# Altium schematic sheet WL-STUKTURNAY.SchDoc: WOLF-LITE
size 594 x 420 mm; Author: UA3REO/R7KBI; Address1: Address1; Address2: Address2; Address3: Address3; Address4: Address4; DocumentNumber: Wolf-Lite; SheetNumber: 1; SheetTotal: 12; Scale: 1:1; DocumentType: Схема электрическая принципиальная; FirstReferrence: АБВГ.123456.001
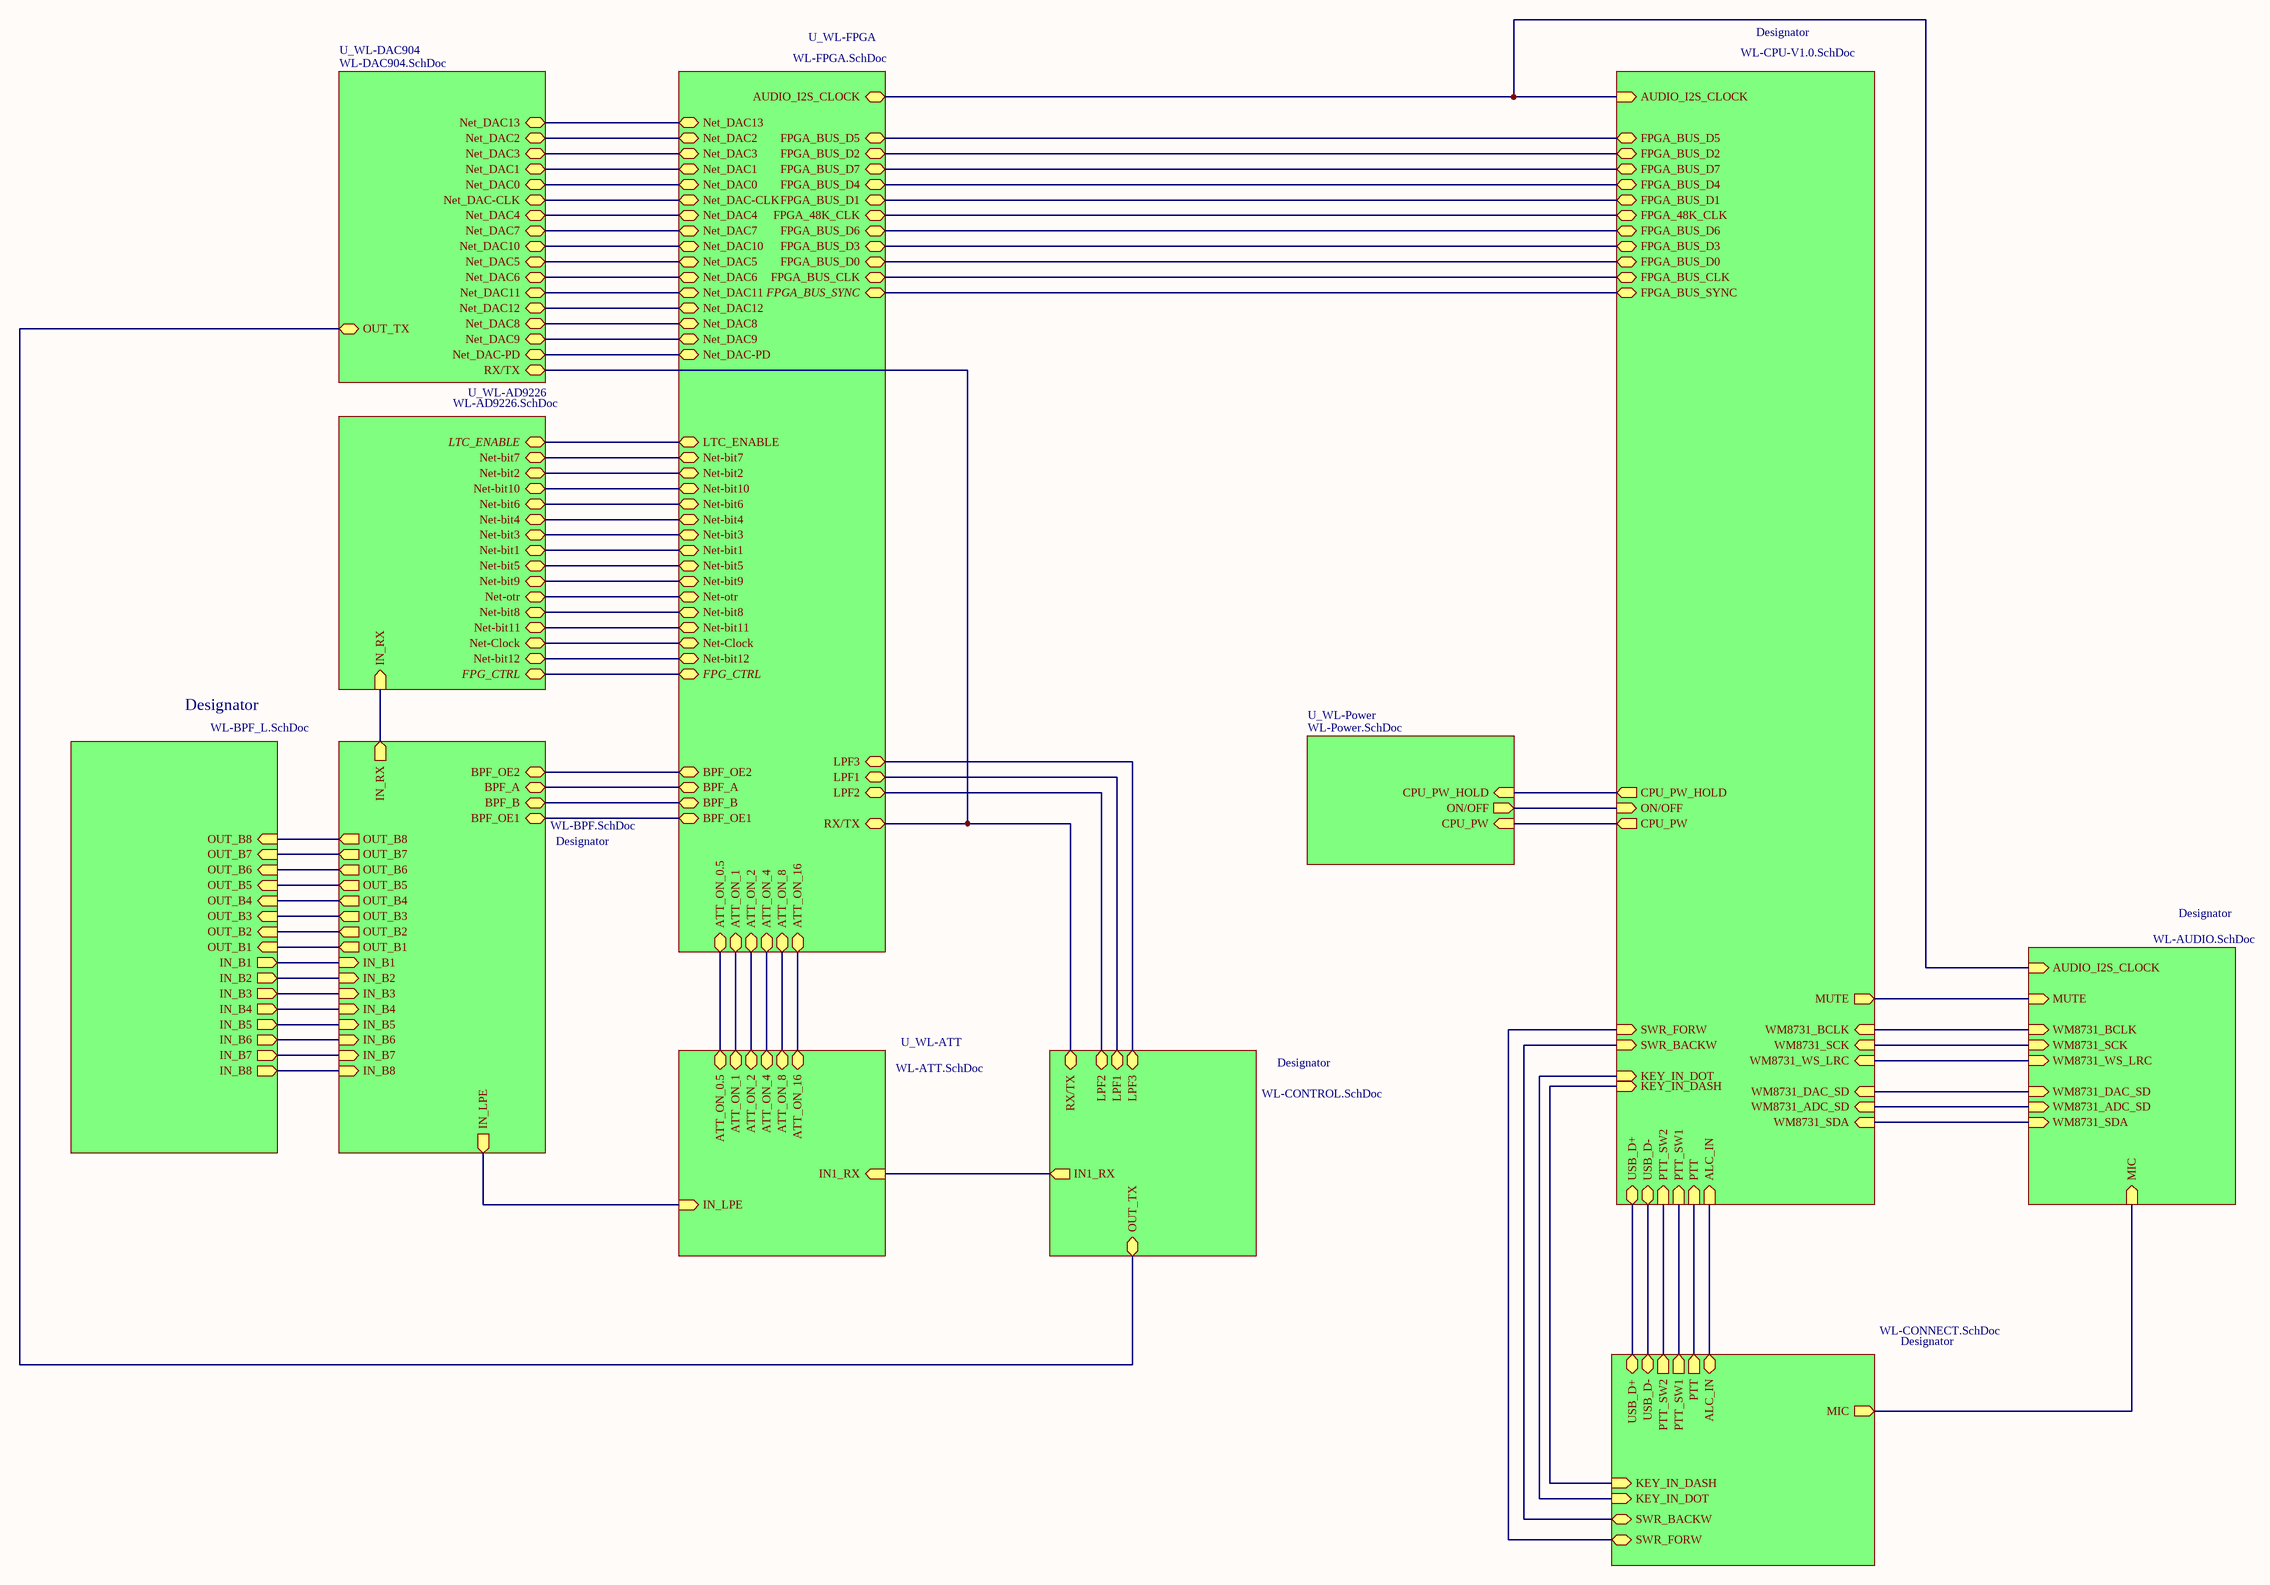
[diagram p0: WL-STUKTURNAY.SchDoc]

## Sub-sheets
Designator = WL-CPU-V1.0.SchDoc: MUTE (out), USB_D+ (bidir), USB_D- (bidir), PTT_SW2 (in), PTT_SW1 (in), PTT (in), FPGA_BUS_D5 (bidir), FPGA_BUS_D2 (bidir), FPGA_BUS_D7 (bidir), FPGA_BUS_D4 (bidir), FPGA_BUS_D1 (bidir), FPGA_48K_CLK (bidir), FPGA_BUS_D6 (bidir), FPGA_BUS_D3 (bidir), FPGA_BUS_D0 (bidir), FPGA_BUS_CLK (bidir), FPGA_BUS_SYNC (bidir), CPU_PW_HOLD (out), ON/OFF (in), CPU_PW (out), KEY_IN_DOT (in), KEY_IN_DASH (in), SWR_FORW (in), SWR_BACKW (in), ALC_IN (in), AUDIO_I2S_CLOCK (in), WM8731_SCK (in), WM8731_BCLK (in), WM8731_WS_LRC (in), WM8731_DAC_SD (in), WM8731_ADC_SD (in), WM8731_SDA (in)
Designator = WL-AUDIO.SchDoc: MUTE (in), MIC (in), WM8731_BCLK (in), WM8731_SCK (in), WM8731_WS_LRC (in), AUDIO_I2S_CLOCK (in), WM8731_DAC_SD (in), WM8731_ADC_SD (in), WM8731_SDA (in)
Designator = WL-CONTROL.SchDoc: OUT_TX (bidir), LPF2 (bidir), LPF1 (bidir), LPF3 (bidir), IN1_RX (out), RX/TX (bidir)
Designator = WL-BPF.SchDoc: IN_RX (out), BPF_OE2 (bidir), BPF_A (bidir), BPF_B (bidir), BPF_OE1 (bidir), OUT_B8 (out), OUT_B7 (out), OUT_B6 (out), OUT_B5 (out), OUT_B4 (out), OUT_B3 (out), OUT_B2 (out), OUT_B1 (out), IN_B1 (in), IN_B2 (in), IN_B3 (in), IN_B4 (in), IN_B5 (in), IN_B6 (in), IN_B7 (in), IN_B8 (in), IN_LPE (out)
Designator = WL-CONNECT.SchDoc: USB_D- (bidir), PTT (out), MIC (out), USB_D+ (bidir), PTT_SW2 (out), PTT_SW1 (out), ALC_IN (bidir), KEY_IN_DASH (in), KEY_IN_DOT (in), SWR_FORW (bidir), SWR_BACKW (bidir)
Designator = WL-BPF_L.SchDoc: OUT_B2 (in), OUT_B3 (in), OUT_B4 (in), OUT_B1 (in), IN_B1 (out), IN_B2 (out), IN_B3 (out), IN_B4 (out), OUT_B7 (in), OUT_B6 (in), OUT_B5 (in), IN_B7 (out), IN_B6 (out), IN_B5 (out), IN_B8 (out), OUT_B8 (in)
U_WL-AD9226 = WL-AD9226.SchDoc: Net-bit7 (bidir), Net-bit2 (bidir), Net-bit10 (bidir), Net-bit6 (bidir), Net-bit4 (bidir), Net-bit3 (bidir), Net-bit1 (bidir), Net-bit5 (bidir), Net-bit9 (bidir), Net-otr (bidir), Net-bit8 (bidir), Net-bit11 (bidir), Net-Clock (bidir), Net-bit12 (bidir), LTC_ENABLE (bidir), IN_RX (in), FPG_CTRL (bidir)
U_WL-ATT = WL-ATT.SchDoc: ATT_ON_1 (bidir), ATT_ON_2 (bidir), ATT_ON_16 (bidir), ATT_ON_8 (bidir), ATT_ON_4 (bidir), ATT_ON_0.5 (bidir), IN_LPE (in), IN1_RX (in)
U_WL-DAC904 = WL-DAC904.SchDoc: Net_DAC13 (bidir), Net_DAC2 (bidir), Net_DAC3 (bidir), Net_DAC1 (bidir), Net_DAC0 (bidir), Net_DAC-CLK (bidir), Net_DAC4 (bidir), Net_DAC7 (bidir), Net_DAC10 (bidir), Net_DAC5 (bidir), Net_DAC6 (bidir), Net_DAC11 (bidir), Net_DAC12 (bidir), Net_DAC8 (bidir), Net_DAC9 (bidir), OUT_TX (bidir), Net_DAC-PD (bidir), RX/TX (bidir)
U_WL-FPGA = WL-FPGA.SchDoc: FPGA_BUS_D5 (bidir), FPGA_BUS_D2 (bidir), FPGA_BUS_D7 (bidir), AUDIO_I2S_CLOCK (bidir), FPGA_BUS_D4 (bidir), FPGA_BUS_D1 (bidir), FPGA_48K_CLK (bidir), FPGA_BUS_D6 (bidir), FPGA_BUS_D3 (bidir), FPGA_BUS_D0 (bidir), FPGA_BUS_CLK (bidir), FPGA_BUS_SYNC (bidir), ATT_ON_0.5 (bidir), ATT_ON_1 (bidir), ATT_ON_2 (bidir), ATT_ON_4 (bidir), ATT_ON_8 (bidir), ATT_ON_16 (bidir), Net_DAC13 (bidir), Net_DAC2 (bidir), Net_DAC3 (bidir), Net_DAC1 (bidir), Net_DAC0 (bidir), Net_DAC-CLK (bidir), Net_DAC4 (bidir), Net_DAC7 (bidir), Net_DAC10 (bidir), Net_DAC5 (bidir), Net_DAC6 (bidir), Net_DAC11 (bidir), Net_DAC12 (bidir), Net_DAC8 (bidir), Net_DAC9 (bidir), Net-bit7 (bidir), Net-bit2 (bidir), Net-bit10 (bidir), Net-bit6 (bidir), Net-bit4 (bidir), Net-bit3 (bidir), Net-bit1 (bidir), Net-bit5 (bidir), Net-bit9 (bidir), Net-otr (bidir), Net-bit8 (bidir), Net-bit11 (bidir), Net-Clock (bidir), Net-bit12 (bidir), BPF_OE2 (bidir), BPF_A (bidir), BPF_B (bidir), BPF_OE1 (bidir), LPF2 (bidir), LPF1 (bidir), LPF3 (bidir), Net_DAC-PD (bidir), RX/TX (bidir), LTC_ENABLE (bidir), FPG_CTRL (bidir)
U_WL-Power = WL-Power.SchDoc: CPU_PW_HOLD (in), ON/OFF (out), CPU_PW (in)

## Nets
(unnamed): sheet U_WL-Power/CPU_PW_HOLD, sheet Designator/CPU_PW_HOLD
(unnamed): sheet U_WL-Power/ON/OFF, sheet Designator/ON/OFF
(unnamed): sheet U_WL-Power/CPU_PW, sheet Designator/CPU_PW
(unnamed): sheet U_WL-AD9226/Net-bit7, sheet U_WL-FPGA/Net-bit7
(unnamed): sheet U_WL-AD9226/Net-bit2, sheet U_WL-FPGA/Net-bit2
(unnamed): sheet U_WL-AD9226/Net-bit10, sheet U_WL-FPGA/Net-bit10
(unnamed): sheet U_WL-AD9226/Net-bit6, sheet U_WL-FPGA/Net-bit6
(unnamed): sheet U_WL-AD9226/Net-bit4, sheet U_WL-FPGA/Net-bit4
(unnamed): sheet U_WL-AD9226/Net-bit3, sheet U_WL-FPGA/Net-bit3
(unnamed): sheet U_WL-AD9226/Net-bit1, sheet U_WL-FPGA/Net-bit1
(unnamed): sheet U_WL-AD9226/Net-bit5, sheet U_WL-FPGA/Net-bit5
(unnamed): sheet U_WL-AD9226/Net-bit9, sheet U_WL-FPGA/Net-bit9
(unnamed): sheet U_WL-AD9226/Net-otr, sheet U_WL-FPGA/Net-otr
(unnamed): sheet U_WL-AD9226/Net-bit8, sheet U_WL-FPGA/Net-bit8
(unnamed): sheet U_WL-AD9226/Net-bit11, sheet U_WL-FPGA/Net-bit11
(unnamed): sheet U_WL-AD9226/Net-Clock, sheet U_WL-FPGA/Net-Clock
(unnamed): sheet U_WL-AD9226/Net-bit12, sheet U_WL-FPGA/Net-bit12
(unnamed): sheet U_WL-AD9226/LTC_ENABLE, sheet U_WL-FPGA/LTC_ENABLE
(unnamed): sheet U_WL-AD9226/IN_RX, sheet Designator/IN_RX
(unnamed): sheet U_WL-AD9226/FPG_CTRL, sheet U_WL-FPGA/FPG_CTRL
(unnamed): sheet U_WL-FPGA/FPGA_BUS_D5, sheet Designator/FPGA_BUS_D5
(unnamed): sheet U_WL-FPGA/FPGA_BUS_D2, sheet Designator/FPGA_BUS_D2
(unnamed): sheet U_WL-FPGA/FPGA_BUS_D7, sheet Designator/FPGA_BUS_D7
(unnamed): sheet U_WL-FPGA/AUDIO_I2S_CLOCK, sheet Designator/AUDIO_I2S_CLOCK, sheet Designator/AUDIO_I2S_CLOCK
(unnamed): sheet U_WL-FPGA/FPGA_BUS_D4, sheet Designator/FPGA_BUS_D4
(unnamed): sheet U_WL-FPGA/FPGA_BUS_D1, sheet Designator/FPGA_BUS_D1
(unnamed): sheet U_WL-FPGA/FPGA_48K_CLK, sheet Designator/FPGA_48K_CLK
(unnamed): sheet U_WL-FPGA/FPGA_BUS_D6, sheet Designator/FPGA_BUS_D6
(unnamed): sheet U_WL-FPGA/FPGA_BUS_D3, sheet Designator/FPGA_BUS_D3
(unnamed): sheet U_WL-FPGA/FPGA_BUS_D0, sheet Designator/FPGA_BUS_D0
(unnamed): sheet U_WL-FPGA/FPGA_BUS_CLK, sheet Designator/FPGA_BUS_CLK
(unnamed): sheet U_WL-FPGA/FPGA_BUS_SYNC, sheet Designator/FPGA_BUS_SYNC
(unnamed): sheet U_WL-FPGA/ATT_ON_0.5, sheet U_WL-ATT/ATT_ON_0.5
(unnamed): sheet U_WL-FPGA/ATT_ON_1, sheet U_WL-ATT/ATT_ON_1
(unnamed): sheet U_WL-FPGA/ATT_ON_2, sheet U_WL-ATT/ATT_ON_2
(unnamed): sheet U_WL-FPGA/ATT_ON_4, sheet U_WL-ATT/ATT_ON_4
(unnamed): sheet U_WL-FPGA/ATT_ON_8, sheet U_WL-ATT/ATT_ON_8
(unnamed): sheet U_WL-FPGA/ATT_ON_16, sheet U_WL-ATT/ATT_ON_16
(unnamed): sheet U_WL-FPGA/Net_DAC13, sheet U_WL-DAC904/Net_DAC13
(unnamed): sheet U_WL-FPGA/Net_DAC2, sheet U_WL-DAC904/Net_DAC2
(unnamed): sheet U_WL-FPGA/Net_DAC3, sheet U_WL-DAC904/Net_DAC3
(unnamed): sheet U_WL-FPGA/Net_DAC1, sheet U_WL-DAC904/Net_DAC1
(unnamed): sheet U_WL-FPGA/Net_DAC0, sheet U_WL-DAC904/Net_DAC0
(unnamed): sheet U_WL-FPGA/Net_DAC-CLK, sheet U_WL-DAC904/Net_DAC-CLK
(unnamed): sheet U_WL-FPGA/Net_DAC4, sheet U_WL-DAC904/Net_DAC4
(unnamed): sheet U_WL-FPGA/Net_DAC7, sheet U_WL-DAC904/Net_DAC7
(unnamed): sheet U_WL-FPGA/Net_DAC10, sheet U_WL-DAC904/Net_DAC10
(unnamed): sheet U_WL-FPGA/Net_DAC5, sheet U_WL-DAC904/Net_DAC5
(unnamed): sheet U_WL-FPGA/Net_DAC6, sheet U_WL-DAC904/Net_DAC6
(unnamed): sheet U_WL-FPGA/Net_DAC11, sheet U_WL-DAC904/Net_DAC11
(unnamed): sheet U_WL-FPGA/Net_DAC12, sheet U_WL-DAC904/Net_DAC12
(unnamed): sheet U_WL-FPGA/Net_DAC8, sheet U_WL-DAC904/Net_DAC8
(unnamed): sheet U_WL-FPGA/Net_DAC9, sheet U_WL-DAC904/Net_DAC9
(unnamed): sheet U_WL-FPGA/BPF_OE2, sheet Designator/BPF_OE2
(unnamed): sheet U_WL-FPGA/BPF_A, sheet Designator/BPF_A
(unnamed): sheet U_WL-FPGA/BPF_B, sheet Designator/BPF_B
(unnamed): sheet U_WL-FPGA/BPF_OE1, sheet Designator/BPF_OE1
(unnamed): sheet U_WL-FPGA/LPF2, sheet Designator/LPF2
(unnamed): sheet U_WL-FPGA/LPF1, sheet Designator/LPF1
(unnamed): sheet U_WL-FPGA/LPF3, sheet Designator/LPF3
(unnamed): sheet U_WL-FPGA/Net_DAC-PD, sheet U_WL-DAC904/Net_DAC-PD
(unnamed): sheet U_WL-FPGA/RX/TX, sheet U_WL-DAC904/RX/TX, sheet Designator/RX/TX
(unnamed): sheet U_WL-DAC904/OUT_TX, sheet Designator/OUT_TX
(unnamed): sheet U_WL-ATT/IN_LPE, sheet Designator/IN_LPE
(unnamed): sheet U_WL-ATT/IN1_RX, sheet Designator/IN1_RX
(unnamed): sheet Designator/MUTE, sheet Designator/MUTE
(unnamed): sheet Designator/USB_D+, sheet Designator/USB_D+
(unnamed): sheet Designator/USB_D-, sheet Designator/USB_D-
(unnamed): sheet Designator/PTT_SW2, sheet Designator/PTT_SW2
(unnamed): sheet Designator/PTT_SW1, sheet Designator/PTT_SW1
(unnamed): sheet Designator/PTT, sheet Designator/PTT
(unnamed): sheet Designator/KEY_IN_DOT, sheet Designator/KEY_IN_DOT
(unnamed): sheet Designator/KEY_IN_DASH, sheet Designator/KEY_IN_DASH
(unnamed): sheet Designator/SWR_FORW, sheet Designator/SWR_FORW
(unnamed): sheet Designator/SWR_BACKW, sheet Designator/SWR_BACKW
(unnamed): sheet Designator/ALC_IN, sheet Designator/ALC_IN
(unnamed): sheet Designator/WM8731_SCK, sheet Designator/WM8731_SCK
(unnamed): sheet Designator/WM8731_BCLK, sheet Designator/WM8731_BCLK
(unnamed): sheet Designator/WM8731_WS_LRC, sheet Designator/WM8731_WS_LRC
(unnamed): sheet Designator/WM8731_DAC_SD, sheet Designator/WM8731_DAC_SD
(unnamed): sheet Designator/WM8731_ADC_SD, sheet Designator/WM8731_ADC_SD
(unnamed): sheet Designator/WM8731_SDA, sheet Designator/WM8731_SDA
(unnamed): sheet Designator/MIC, sheet Designator/MIC
(unnamed): sheet Designator/OUT_B8, sheet Designator/OUT_B8
(unnamed): sheet Designator/OUT_B7, sheet Designator/OUT_B7
(unnamed): sheet Designator/OUT_B6, sheet Designator/OUT_B6
(unnamed): sheet Designator/OUT_B5, sheet Designator/OUT_B5
(unnamed): sheet Designator/OUT_B4, sheet Designator/OUT_B4
(unnamed): sheet Designator/OUT_B3, sheet Designator/OUT_B3
(unnamed): sheet Designator/OUT_B2, sheet Designator/OUT_B2
(unnamed): sheet Designator/OUT_B1, sheet Designator/OUT_B1
(unnamed): sheet Designator/IN_B1, sheet Designator/IN_B1
(unnamed): sheet Designator/IN_B2, sheet Designator/IN_B2
(unnamed): sheet Designator/IN_B3, sheet Designator/IN_B3
(unnamed): sheet Designator/IN_B4, sheet Designator/IN_B4
(unnamed): sheet Designator/IN_B5, sheet Designator/IN_B5
(unnamed): sheet Designator/IN_B6, sheet Designator/IN_B6
(unnamed): sheet Designator/IN_B7, sheet Designator/IN_B7
(unnamed): sheet Designator/IN_B8, sheet Designator/IN_B8

## Notes on the sheet
- Перв. примен.
- Справ. №
- Подп. и дата
- Инв. № дубл.
- Взам. инв. №
- Разраб.
- Изм.
- Лист
- № докум.
- Подп.
- Дата
- Лит.
- Масса
- Масштаб
- Пров.
- Т.контр.
- Листов
- Инв. № подл.
- Утв.
- Н.контр.
- 2.106-A2
- Копировал
- Формат А2